# EAGLE design CapstoneProject16 (EAGLE 7.5.0)
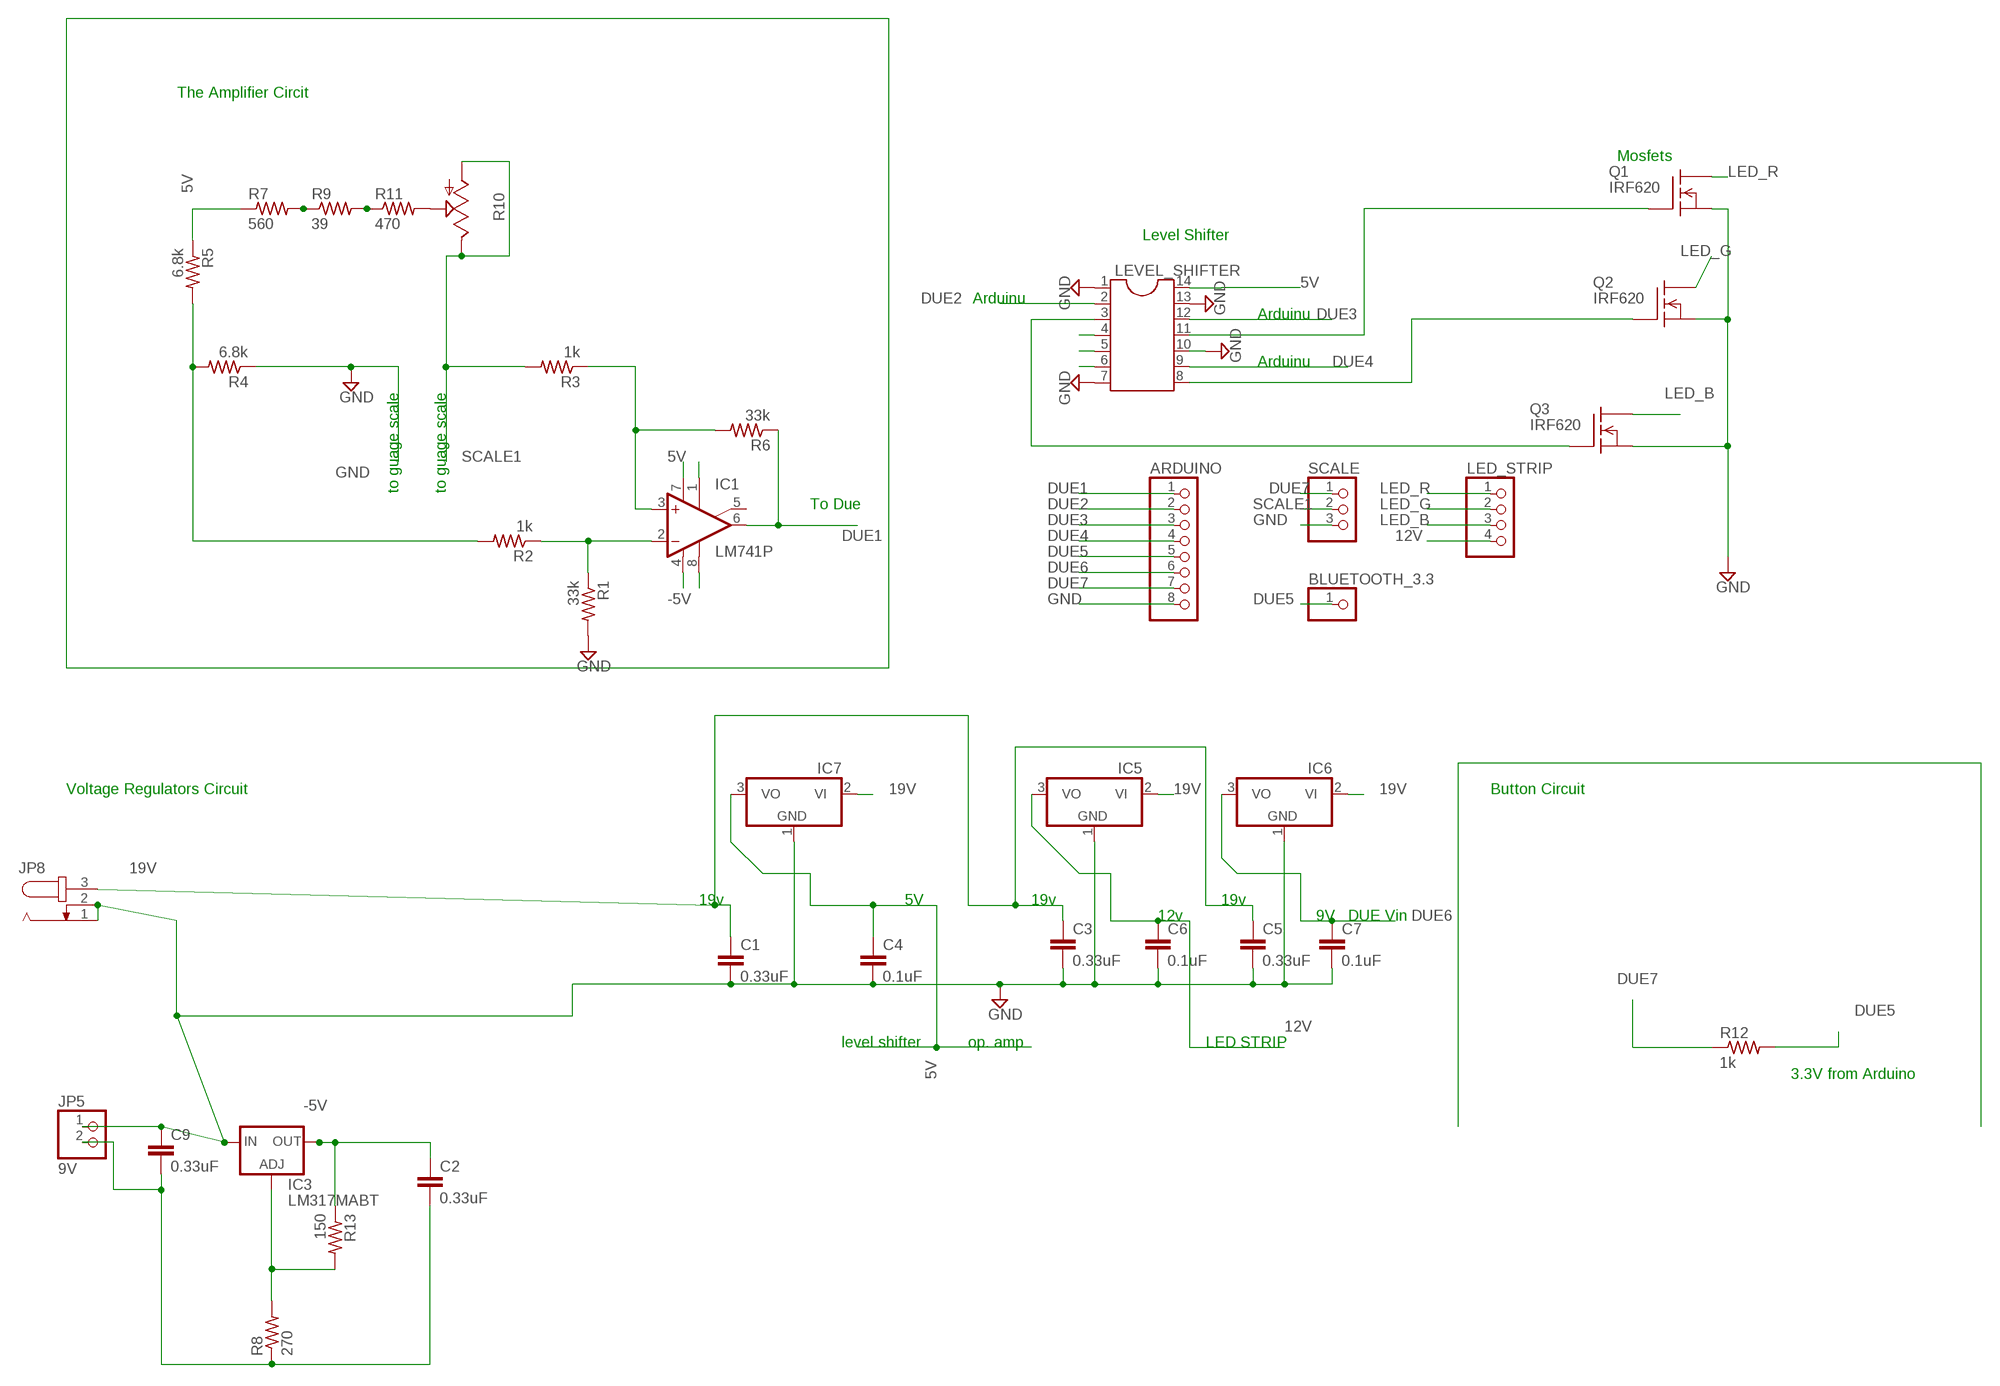
[diagram p0: schematic, sheet 1]

## Parts
ARDUINO  PINHD-1X8  [1X08]
BLUETOOTH_3.3  PINHD-1X1  [1X01]
C1  0.33uF  C2,5-3  [C2.5-3]
C2  0.33uF  C2,5-3  [C2.5-3]
C3  0.33uF  C2,5-3  [C2.5-3]
C4  0.1uF  C2,5-3  [C2.5-3]
C5  0.33uF  C2,5-3  [C2.5-3]
C6  0.1uF  C2,5-3  [C2.5-3]
C7  0.1uF  C2,5-3  [C2.5-3]
C9  0.33uF  C2,5-3  [C2.5-3]
IC1  LM741P  [DIL08]
IC3  LM317MABT  [TO220L1]
IC5  7905T  [TO220H]
IC6  7905T  [TO220H]
IC7  79L05Z  [TO92]
JP5  9V  PINHD-1X2  [1X02]
JP8  JACK-PLUG1  [SPC4078]
LED_STRIP  PINHD-1X4  [1X04]
LEVEL_SHIFTER  DIL14  [DIL14]
Q1  IRF620  [TO220]
Q2  IRF620  [TO220]
Q3  IRF620  [TO220]
R1  33k  R-US_0204/7  [0204/7]
R2  1k  R-US_0204/7  [0204/7]
R3  1k  R-US_0204/7  [0204/7]
R4  6.8k  R-US_0204/7  [0204/7]
R5  6.8k  R-US_0204/7  [0204/7]
R6  33k  R-US_0204/7  [0204/7]
R7  560  R-US_0204/7  [0204/7]
R8  270  R-US_0204/7  [0204/7]
R9  39  R-US_0204/7  [0204/7]
R10  TRIM_US-S63P  [S63P]
R11  470  R-US_0204/7  [0204/7]
R12  1k  R-US_0204/7  [0204/7]
R13  150  R-US_0204/7  [0204/7]
SCALE  PINHD-1X3  [1X03]

## Nets
5V: C4.1 IC1.7(V+) IC7.3(VO) LEVEL_SHIFTER.14 R5.1 R7.1
12V: C6.1 IC5.3(VO) LED_STRIP.4
19V: C1.1 C3.1 C5.1 IC5.2(VI) IC6.2(VI) IC7.2(VI) JP8.3
-5V: C2.1 IC1.4(V-) IC3.2(OUT) R13.1
DUE1: ARDUINO.1 IC1.6(OUT) R6.1
DUE2: ARDUINO.2 LEVEL_SHIFTER.2
DUE3: ARDUINO.3 LEVEL_SHIFTER.12
DUE4: ARDUINO.4 LEVEL_SHIFTER.9
DUE5: ARDUINO.5 BLUETOOTH_3.3.1 R12.2
DUE6: ARDUINO.6 C7.1 IC6.3(VO)
DUE7: ARDUINO.7 R12.1 SCALE.1
GND: ARDUINO.8 C1.2 C3.2 C4.2 C5.2 C6.2 C7.2 C9.1 IC3.3(IN) IC5.1(GND) IC6.1(GND) IC7.1(GND) JP5.1 JP8.1 JP8.2 LEVEL_SHIFTER.1 LEVEL_SHIFTER.7 LEVEL_SHIFTER.10 LEVEL_SHIFTER.13 Q1.3(S) Q2.3(S) Q3.3(S) R1.2 R4.1 SCALE.3
LED_B: LED_STRIP.3 Q3.2(D)
LED_G: LED_STRIP.2 Q2.2(D)
LED_R: LED_STRIP.1 Q1.2(D)
N$2: R2.2 R4.2 R5.2
N$3: IC1.2(-IN) R1.1 R2.1
N$4: IC1.3(+IN) R3.1 R6.2
N$5: LEVEL_SHIFTER.4
N$6: R10.S R11.2
N$8: LEVEL_SHIFTER.5
N$9: R7.2 R9.1
N$10: LEVEL_SHIFTER.6
N$12: C2.2 C9.2 JP5.2 R8.1
N$13: IC3.1(ADJ) R8.2 R13.2
N$15: R9.2 R11.1
N$27: LEVEL_SHIFTER.11 Q1.1(G)
N$28: LEVEL_SHIFTER.8 Q2.1(G)
N$29: LEVEL_SHIFTER.3 Q3.1(G)
N$31: IC1.1(ON1)
N$33: IC1.8(OPT)
SCALE1: R3.2 R10.A R10.E SCALE.2
Unconnected: IC1.5(ON2)

## Notes on the sheet
- The Amplifier Circit
- Mosfets
- Level Shifter
- Arduinu
- Arduinu
- Arduinu
- to guage scale | to guage scale
- To Due
- Voltage Regulators Circuit | Button Circuit
- 19v | 5V | 19v | 19v
- 12v | 9V | DUE Vin
- level shifter | op. amp | LED STRIP
- 3.3V from Arduino

## Library data of the parts
ARDUINO = pinhead:PINHD-1X8: PIN HEADER
BLUETOOTH_3.3 = pinhead:PINHD-1X1: PIN HEADER
C1-C7 C9 = capacitor-wima:C: CAPACITOR naming: grid - package width
IC1 = linear:*741: OP AMP
IC3 = v-reg:LM317?*: 500 mA Adjustable Output Positive Voltage Regulator Source: http://www.onsemi.co.jp .. LM317M-D.PDF
IC5-IC7 = linear:79*: Negative VOLTAGE REGULATOR
JP5 = pinhead:PINHD-1X2: PIN HEADER
JP8 = con-jack:JACK-PLUG: DC POWER JACK Power Jack, DC, Right Angle, Through Hole, Rated 5A at 16VDC, PC Terminals Distributor: Farnell (www.Farnell.de) Drawing: 84N1161.pdf / 84N1162.pdf Manufacturer: SPC Technology (www.spctechnology.com) Type: SPC4077 / SPC 4078; OC_FARNELL: unknown; OC_NEWARK: unknown
LED_STRIP = pinhead:PINHD-1X4: PIN HEADER
LEVEL_SHIFTER = ic-package:DIL14: Dual In Line / Socket
Q1-Q3 = transistor-fet:IRF620: N-Channel Enhancement MOSFET (HEXFET); 200V; 5,2A; 0,8Ohm
R1-R9 R11-R13 = resistor:R-US_: RESISTOR, American symbol
R10 = pot:TRIM_US-: POTENTIOMETER
SCALE = pinhead:PINHD-1X3: PIN HEADER

## Board
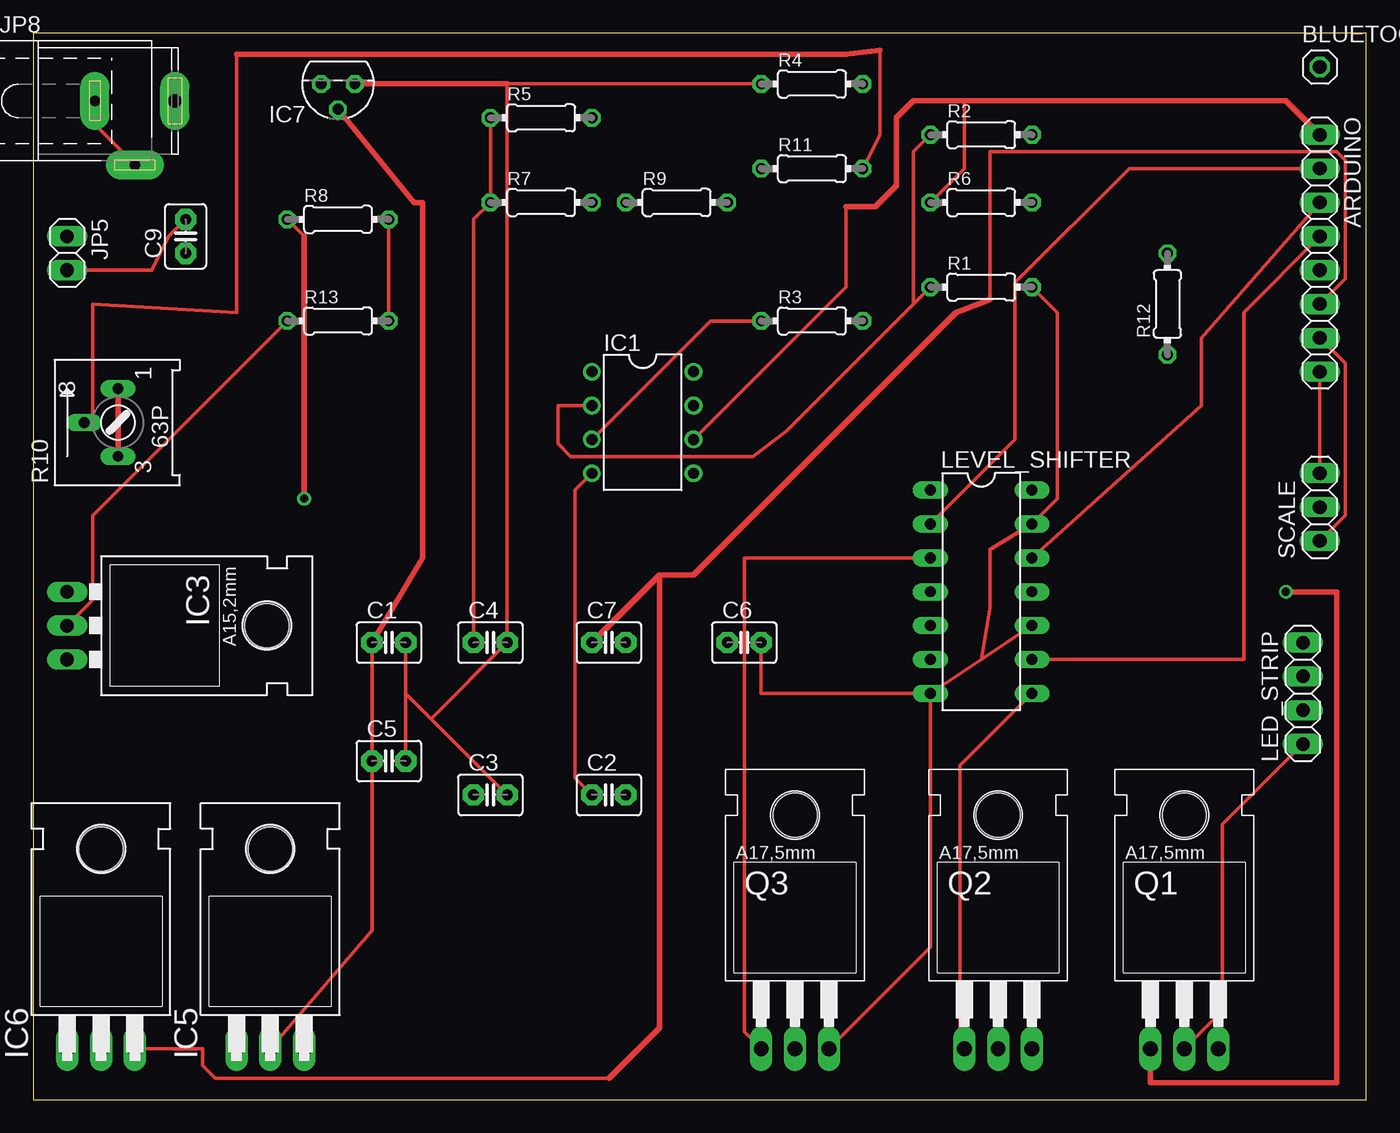
[diagram p1: board, top side]
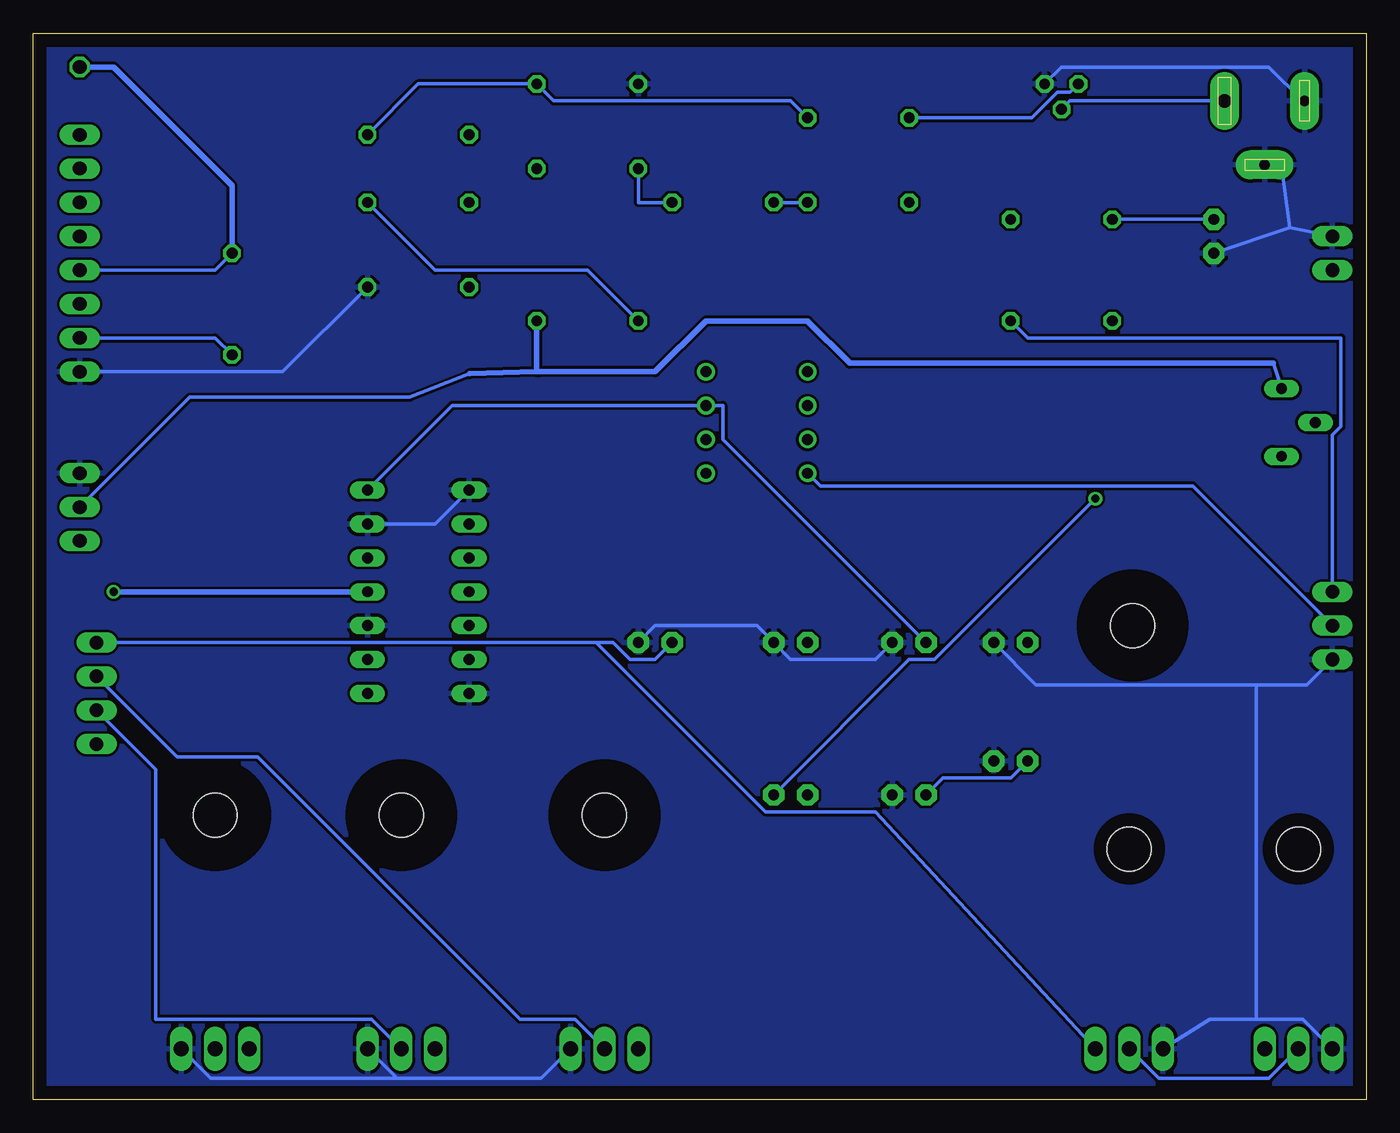
[diagram p2: board, bottom side, seen from below]

Size 100 x 80 mm. Coordinates in mm from the lower left corner, seen from the top.
Outline: 0,0 100,0 100,80 0,80 0,0
Copper layers (1*16): Top 0.035mm / dielectric 1.5mm / Bottom 0.035mm
Design rules "default": minimum track width 10mil, minimum drill 24mil, track to track 8mil, track to pad 8mil, pad to pad 8mil, via to via 8mil, smd to smd 8mil, copper to edge 40mil, drill to drill 8mil, minimum pad ring 10mil, minimum via ring 8mil, stop-mask expansion 4mil, vias tented up to drill 0mil, thermal gap 10mil

### Footprints (pad centres in the part's own frame; a part is rotated, then mirrored left to right if it is on the bottom)
1X08 = drill 1.016 long: 1 -8.89,0; 2 -6.35,0; 3 -3.81,0; 4 -1.27,0; 5 1.27,0; 6 3.81,0; 7 6.35,0; 8 8.89,0
1X01 = drill 1.016 octagon: 1 0,0
C2.5-3 = drill 0.813 pad 1.6 octagon: 1 -1.27,0; 2 1.27,0
DIL08 = drill 0.813 pad 1.27: 1 -3.81,-3.81; 2 -1.27,-3.81; 3 1.27,-3.81; 4 3.81,-3.81; 5 3.81,3.81; 6 1.27,3.81; 7 -1.27,3.81; 8 -3.81,3.81
TO220L1 = drill 1.016 long: 1 -2.54,-3.81; 2 0,-3.81; 3 2.54,-3.81 | hole 3.302: 0,11.176
TO220H = drill 1.118 long: 1 -2.54,-10.16; 2 0,-10.16; 3 2.54,-10.16 | hole 3.302: 0,4.826
TO92 = drill 0.813 octagon: 1 -1.27,0; 2 0,1.905; 3 1.27,0
1X02 = drill 1.016 long: 1 -1.27,0; 2 1.27,0
SPC4078 = drill 0.8 pad 2.184 long: 1 -3,0; 2 0,-4.8 | drill 1 pad 2.184 long: 3 3,0
1X04 = drill 1.016 long: 1 -3.81,0; 2 -1.27,0; 3 1.27,0; 4 3.81,0
DIL14 = drill 0.813 long: 1 -7.62,-3.81; 2 -5.08,-3.81; 3 -2.54,-3.81; 4 0,-3.81; 5 2.54,-3.81; 6 5.08,-3.81; 7 7.62,-3.81; 8 7.62,3.81; 9 5.08,3.81; 10 2.54,3.81; 11 0,3.81; 12 -2.54,3.81; 13 -5.08,3.81; 14 -7.62,3.81
TO220 = drill 1.118 long: 1 -2.54,-6.35; 2 0,-6.35; 3 2.54,-6.35 | hole 3.302: 0,11.176
0204/7 = drill 0.813 octagon: 1 -3.81,0; 2 3.81,0
S63P = drill 0.813 long: A 2.54,0; E -2.54,0; S 0,2.54
1X03 = drill 1.016 long: 1 -2.54,0; 2 0,0; 3 2.54,0

### Placement (x,y rotation side)
ARDUINO  96.52,63.5 270 top
BLUETOOTH_3.3  96.52,77.47 0 top
C1  26.67,34.29 0 top
C2  43.18,22.86 0 top
C3  34.29,22.86 0 top
C4  34.29,34.29 0 top
C5  26.67,25.4 0 top
C6  53.34,34.29 0 top
C7  43.18,34.29 0 top
C9  11.43,64.77 90 top
IC1  45.72,50.8 270 top
IC3  6.35,35.56 270 top
IC5  17.78,13.97 0 top
IC6  5.08,13.97 0 top
IC7  22.86,76.2 180 top
JP5  2.54,63.5 270 top
JP8  7.62,74.93 0 top
LED_STRIP  95.25,30.48 90 top
LEVEL_SHIFTER  71.12,38.1 270 top
Q1  86.36,10.16 0 top
Q2  72.39,10.16 0 top
Q3  57.15,10.16 0 top
R1  71.12,60.96 0 top
R2  71.12,72.39 0 top
R3  58.42,58.42 0 top
R4  58.42,76.2 0 top
R5  38.1,73.66 0 top
R6  71.12,67.31 0 top
R7  38.1,67.31 0 top
R8  22.86,66.04 0 top
R9  48.26,67.31 0 top
R10  6.35,50.8 90 top
R11  58.42,69.85 0 top
R12  85.09,59.69 90 top
R13  22.86,58.42 0 top
SCALE  96.52,44.45 90 top

### Tracks (layer width: path | path; a pad name or v marks a point on that pad's centre or on a via)
5V
  Top 0.254: R5.1 R7.1 33.02,66.04 C4.1
  Bottom 0.254: IC7.3 22.23,75.56 23.18,75.56 25.08,73.66 R5.1 | LEVEL_SHIFTER.14 68.58,52.07 IC1.7 48.26,52.07 48.26,49.53 C4.1
12V
  Bottom 0.254: 57.78,34.29 56.52,34.29 55.24,33.02 53.34,33.02 C6.1 | 57.78,34.29 LED_STRIP.4 | IC5.3 36.83,21.59 45.09,21.59 57.78,34.29
19V
  Top 0.254: C1.1 C5.1 25.4,12.7 IC5.2
  Top 0.406: IC7.2 28.57,67.31 29.21,67.31 29.21,40.64 C1.1
  Bottom 0.254: IC7.2 22.23,74.93 JP8.3 | IC6.2 7.3,1.59 15.56,1.59 IC5.2 | C3.1 31.75,24.13 26.67,24.13 C5.1
-5V
  Top 0.254: IC1.4 40.64,45.72 40.64,24.13 C2.1 | R13.1 4.45,43.81 4.45,37.47 IC3.2
  Bottom 0.254: IC1.4 40.96,46.04 13.02,46.04 IC3.2
DUE1
  Top 0.254: IC1.6 60.96,60.96 60.96,66.99 | 69.85,74.93 69.85,69.85 R6.1
  Top 0.406: ARDUINO.1 93.98,74.93 69.85,74.93 66.04,74.93 64.77,73.66 64.77,68.58 63.18,66.99 60.96,66.99
DUE2
  Top 0.254: LEVEL_SHIFTER.2 73.66,49.53 73.66,61.28 82.23,69.85 ARDUINO.2
DUE3
  Top 0.254: LEVEL_SHIFTER.12 87.63,52.07 87.63,57.15 ARDUINO.3
DUE4
  Top 0.254: LEVEL_SHIFTER.9 90.81,33.02 90.81,59.05 ARDUINO.4
DUE5
  Bottom 0.254: R12.2 86.36,62.23 ARDUINO.5
  Bottom 0.406: R12.2 85.09,68.58 93.98,77.47 BLUETOOTH_3.3.1
DUE6
  Top 0.254: ARDUINO.6 98.42,61.59 98.42,70.48 97.79,71.12 71.75,71.12 71.75,60.01 | IC6.3 12.7,3.81 12.7,2.54 13.65,1.59 43.18,1.59
  Top 0.406: 43.18,1.59 46.99,5.4 46.99,39.37 | 46.99,39.37 C7.1 | 46.99,39.37 49.53,39.37 69.22,59.05 71.75,60.01
DUE7
  Top 0.254: SCALE.1 98.42,43.81 98.42,55.24 ARDUINO.7
  Bottom 0.254: R12.1 86.36,57.15 ARDUINO.7
GND
  Top 0.254: 71.12,33.02 LEVEL_SHIFTER.7 | LEVEL_SHIFTER.10 71.12,33.02 | 71.12,33.02 71.75,36.83 71.75,41.27 LEVEL_SHIFTER.13 76.83,45.09 76.83,59.05 R1.2 | ARDUINO.8 SCALE.3 | Q3.3 67.31,11.43 LEVEL_SHIFTER.7 | R4.1 35.56,76.2 C4.2 29.84,28.57 | JP8.2 7.62,70.17 4.76,73.03 4.76,74.93 JP8.1 | C1.2 27.94,30.48 | 27.94,30.48 C5.2 | 27.94,30.48 29.84,28.57 | 29.84,28.57 C3.2 | LEVEL_SHIFTER.7 54.61,30.48 C6.2
  Top 0.406: IC7.1 35.56,76.2
  Bottom 0.254: Q3.3 61.91,1.59 72.71,1.59 | Q2.3 72.71,1.59 | Q1.3 86.68,1.59 72.71,1.59 | LEVEL_SHIFTER.1 69.85,43.18 LEVEL_SHIFTER.13 | ARDUINO.8 81.28,54.61 R1.2 | 5.71,65.41 6.35,69.85 7.62,69.85 JP8.2 | 5.71,65.41 JP5.1 | 5.71,65.41 C9.1 | IC7.1 22.86,77.47 7.3,77.47 4.76,74.93 JP8.1 | IC6.1 4.76,6.03 8.26,6.03 | 8.26,6.03 11.75,6.03 IC5.1 | IC3.3 4.45,31.11 8.26,31.11 | 8.26,31.11 24.77,31.11 C1.2 | C4.2 36.83,33.02 43.18,33.02 C7.2 45.72,35.56 53.34,35.56 C6.2 | 8.26,31.11 8.26,6.03
  pour Bottom: -5.08,81.28 -5.08,-2.54 101.6,-2.54 101.6,81.28
LED_B
  Bottom 0.254: LED_STRIP.3 89.22,25.72 83.19,25.72 63.5,6.03 59.37,6.03 Q3.2
LED_G
  Bottom 0.254: LED_STRIP.2 90.81,24.77 90.81,6.03 74.61,6.03 Q2.2
LED_R
  Top 0.254: LED_STRIP.1 89.22,20.64 89.22,6.67 Q1.2
N$2
  Bottom 0.254: R5.2 43.18,74.93 60.96,74.93 R4.2 71.12,76.2 R2.2
N$3
  Top 0.254: IC1.2 39.37,52.07 39.37,49.21 40.32,48.26 53.98,48.26 56.52,50.16 66.04,59.69 | R1.1 66.04,59.69 | R2.1 66.04,71.12 66.04,59.69
N$4
  Top 0.254: IC1.3 50.8,58.42 R3.1
  Bottom 0.254: R6.2 69.85,62.23 58.42,62.23 R3.1
N$6
  Top 0.254: R10.S 4.45,51.44 4.45,59.69 15.24,59.05 15.24,78.42 | 63.5,78.74 63.5,72.39 R11.2
  Top 0.406: 15.24,78.42 60.96,78.42 63.5,78.74
N$9
  Bottom 0.254: R9.1 R7.2
N$12  (via drill 0.61)
  Top 0.254: JP5.2 8.89,62.23 10.16,64.77 C9.2 | R8.1 20.32,64.77
  Top 0.406: 20.32,64.77 v20.32,45.09
  Bottom 0.254: C9.2 R8.1 | C2.2 34.29,33.02 32.38,33.02 v20.32,45.09
N$13
  Top 0.254: R8.2 R13.2
  Bottom 0.254: IC3.1 2.54,49.85 1.91,50.48 1.91,57.15 25.4,57.15 R13.2
N$15
  Bottom 0.254: R11.1 54.61,67.31 R9.2
N$27  (via drill 0.61)
  Top 0.406: Q1.1 83.82,1.27 97.79,1.27 97.79,38.1 v93.98,38.1
  Bottom 0.406: v93.98,38.1 LEVEL_SHIFTER.11
N$28
  Top 0.254: LEVEL_SHIFTER.8 69.53,25.08 69.53,4.13 Q2.1
N$29
  Top 0.254: LEVEL_SHIFTER.3 53.34,40.64 53.34,5.08 Q3.1
SCALE1
  Top 0.406: R10.A R10.E
  Bottom 0.254: 67.27,54.46 71.75,52.7 88.27,52.7 SCALE.2 | 6.99,55.24 R10.A
  Bottom 0.406: 6.99,55.24 38.73,55.24 41.91,58.42 49.53,58.42 53.34,54.61 62.04,54.61 62.23,54.6 | 62.23,54.6 67.27,54.46 | R3.2 62.23,54.6 | 62.23,54.6